# Altium schematic sheet SHT30.SchDoc
size A4; Revision: 10
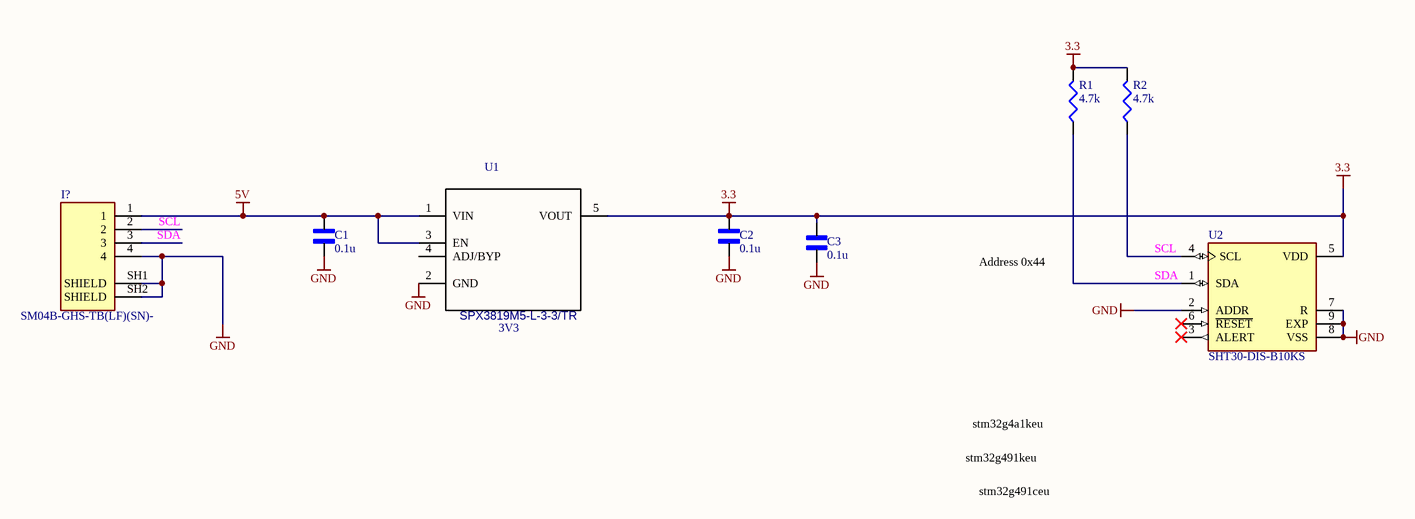
[diagram p0: SHT30.SchDoc]

## Parts
C1  value 0.1u  [CAPC1005X55N]  (hidden comment: GCM155R71H104KE02D)
C2  value 0.1u  [CAPC1005X55N]  (hidden comment: GCM155R71H104KE02D)
C3  value 0.1u  [CAPC1005X55N]  (hidden comment: GCM155R71H104KE02D)
I?  SM04B-GHS-TB(LF)(SN)-  [JST_SM04B-GHS-TB(LF)(SN)-]
R1  value 4.7k  [RESC1005X40N]  (hidden comment: RC0402FR-074K7L)
R2  value 4.7k  [RESC1005X40N]  (hidden comment: RC0402FR-074K7L)
U1  value 3V3  [*SOT95P280X145-5N]  (hidden comment: SPX3819M5-L-3-3/TR)
U2  SHT30-DIS-B10KS  [XDCR_SHT30-DIS-B10KS]

## Nets
3.3: C2.2 C3.2 R1.2 R2.2 U1.5(VOUT) U2.5(VDD)
5V: C1.2 I?.1 U1.1(VIN) U1.3(EN)
GND: C1.1 C2.1 C3.1 I?.4 I?.SH1(SHIELD) I?.SH2(SHIELD) U1.2(GND) U2.2(ADDR) U2.7(R) U2.8(VSS) U2.9(EXP)
SCL: I?.2 R2.1 U2.4(SCL)
SDA: I?.3 R1.1 U2.1(SDA)

Not connected (* = marked no-connect by the designer): U1 4(ADJ/BYP); U2 3(ALERT)* 6(~{RESET})*

## Notes on the sheet
- Address 0x44
- stm32g4a1keu
- stm32g491keu
- stm32g491ceu

## Library data of the parts
C1-C3 = GCM155R71H104KE02D: GCM155R71H104KE02D, Чип 0402 X7R 0.1uF +10% 50V,Конденсатор; MF: Murata; Type: SMD; SnapEDA_Link: https://www.snapeda.com/parts/GCM155R71H104KE02D/Murata%20Electronics%20North%20America/view-part/597463/?ref=snap; Package: 0402; MP: GCM155R71H104KE02D; ChipDip_Link: https://www.chipdip.ru/product/gcm155r71h104ke02d-murata
I? = SM04B-GHS-TB(LF)(SN)-: Connector Header Surface Mount, Right Angle 4 position 0.049 _1.25mm_; MF: JST Sales; MP: SM04B-GHS-TB(LF)(SN); Package: None; Value: *; SnapEDA_Link: https://www.snapeda.com/parts/SM04B-GHS-TB%28LF%29%28SN%29-/JST%20Sales%20America%20Inc./view-part/2759740/?ref=snap; HelpURL: http://www.farnell.com/datasheets/2082975.pdf; System: Connector; ChipDip_Link: https://www.chipdip.ru/product/sm04b-ghs-tb-lf-sn-gh-1.25mm-header-side-ent
R1 R2 = RC0402FR-074K7L: 0.062Вт 0402 4.7 кОм, 1%, Чип резистор (SMD); Pacage Metric: 1005; MF: Yageo or NXP; ChipDip_Link: https://www.chipdip.ru/product0/9000189640; HelpURL: https://www.chipdip.ru/product0/9000189640; Package: RC0402; Type: SMD; MP: RC0402FR-074K7L; SnapEDA_Link: https://www.snapeda.com/parts/CRGCQ0402F10K/TE%20Connectivity/view-part/3186991/?ref=search&t=0402%2010k
U1 = SPX3819M5-L-3-3/TR: Low Dropout Voltage Regulator, 3.3V 0.5A, В±1%, 2.5 to 16 Vin, 5-Pin SOT-23; MF: MaxLinear, Inc.; Package: SOT-23-5 Exar; SnapEDA_Link: https://www.snapeda.com/parts/SPX3819M5-L/MaxLinear%2C%20Inc./view-part/?ref=snap; Type: SMD; ChipDip_Link: https://www.chipdip.ru/product/spx3819m5-l-3-3-tr; HelpURL: http://www.farnell.com/datasheets/2614478.pdf; MP: SPX3819M5-L-3-3/TR
U2 = SHT30-DIS-B10KS: SENSOR HUMID/TEMP 5V I2C 2% SMD; Package: None; Price: None; Value: *; MP: SHT30-DIS-B10KS; Availability: Unavailable; HelpURL: https://www.mouser.com/datasheet/2/682/Sensirion_Humidity_Sensors_SHT3x_Datasheet_digital-971521.pdf